# EAGLE design Interface_Board_V1.0 (EAGLE 9.1.1)
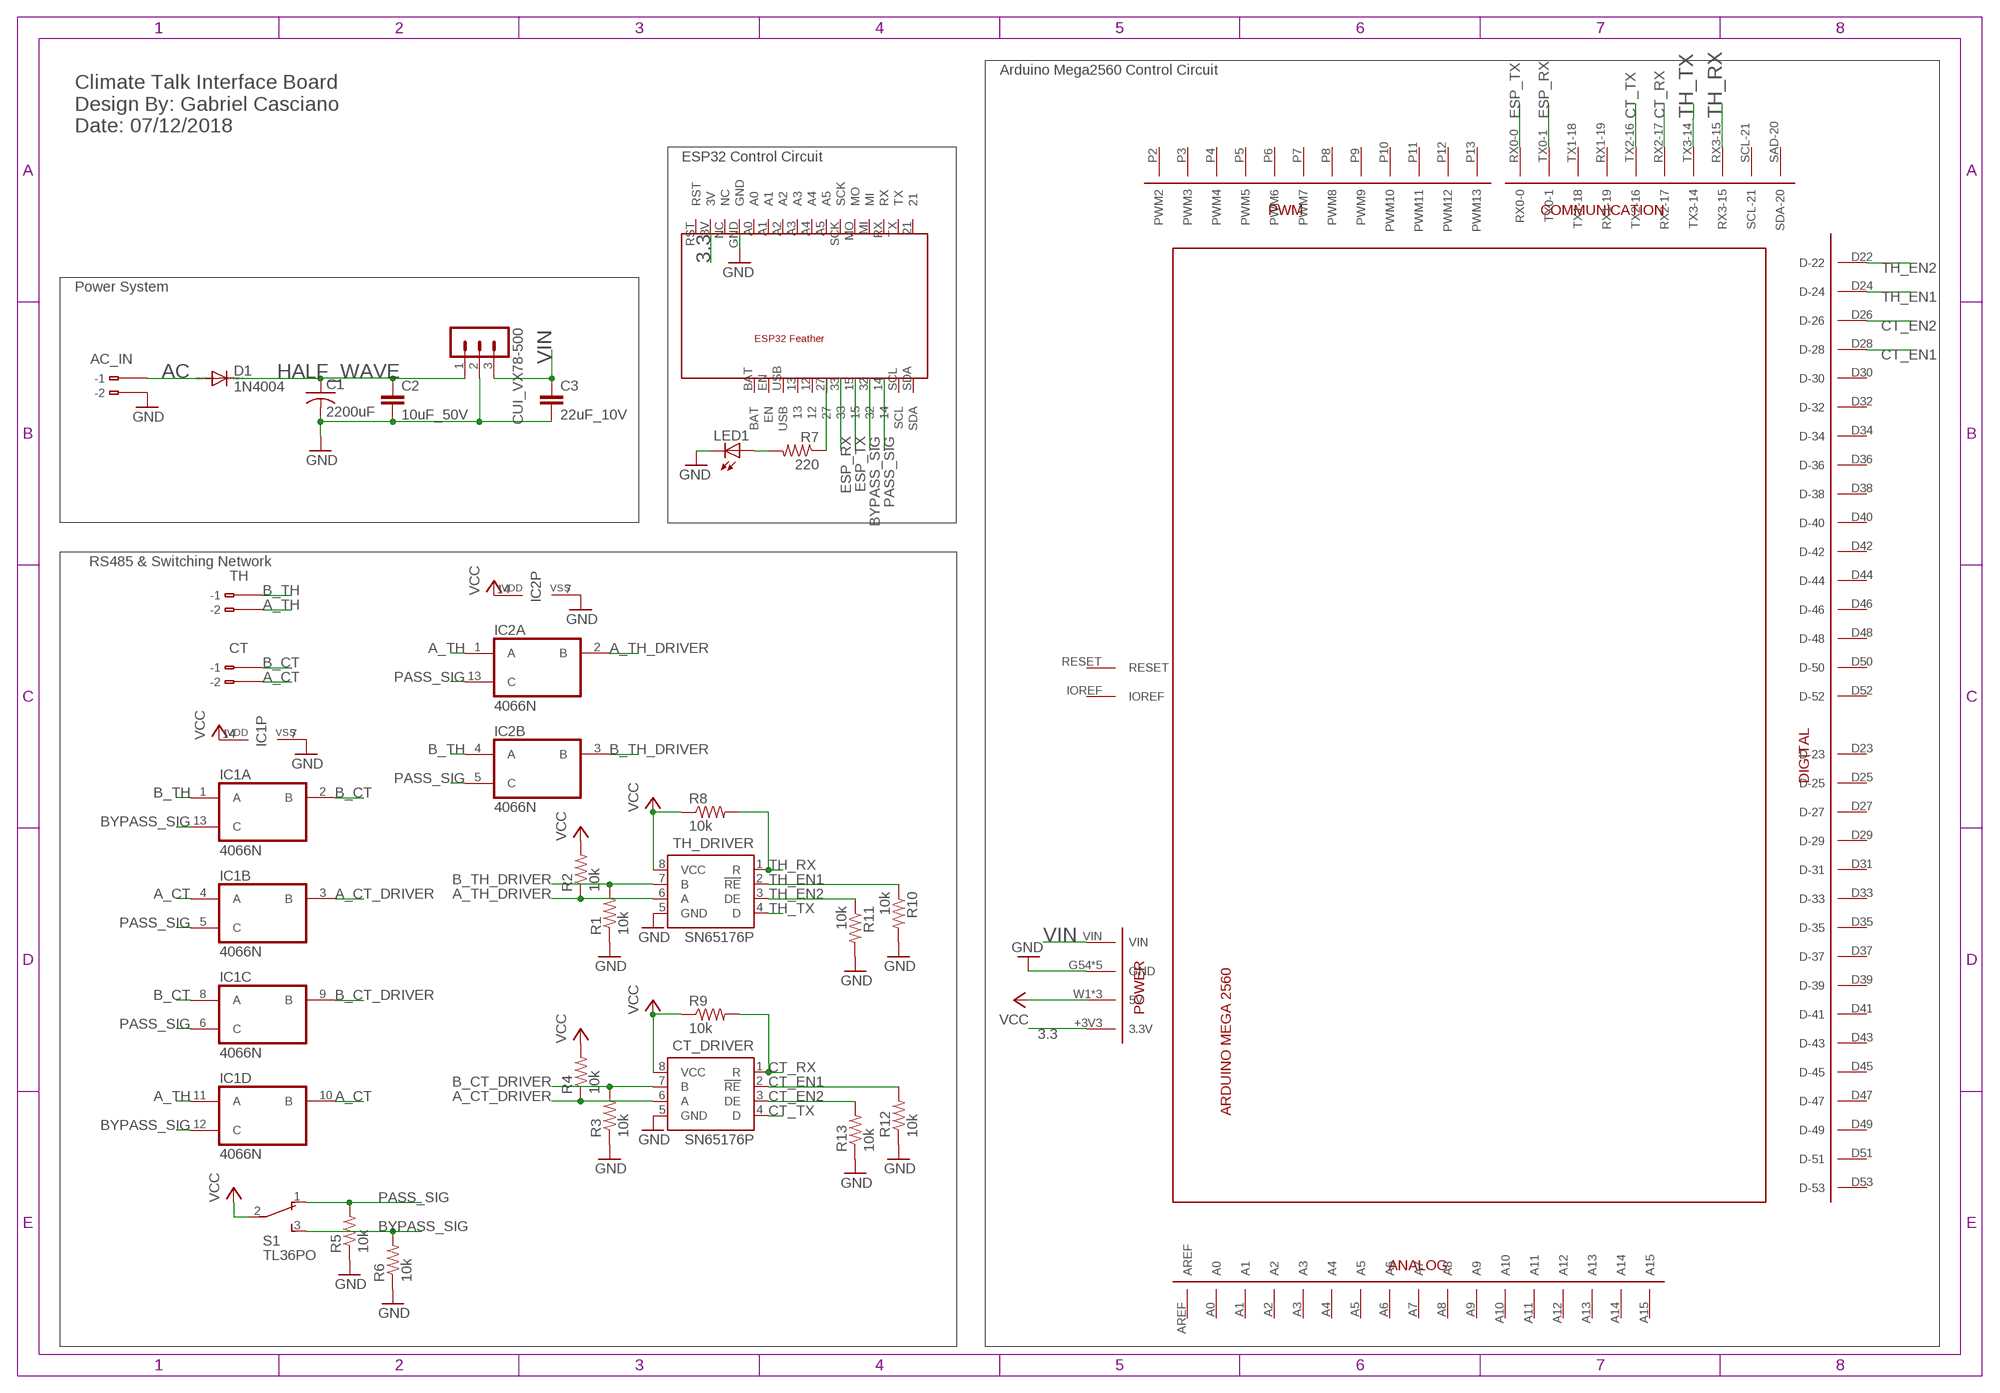
[diagram p0: schematic, sheet 1]

## Parts
AC_IN  233-102  [233-102]
C1  2200uF  C-US102-054X133  [C102-054X133]
C2  10uF_50V  C-EU025-025X050  [C025-025X050]
C3  22uF_10V  C-EU025-025X050  [C025-025X050]
CT  233-102  [233-102]
CT_DRIVER  SN65176P  [DIL08]
CUI_VX78-500  MA03-1  [MA03-1]
D1  1N4004  [DO41-10]
IC1  4066N  [DIL14]
IC2  4066N  [DIL14]
LED1  LED5MM  [LED5MM]
R1  10k  R-US_0204/7  [0204/7]
R2  10k  R-US_0204/7  [0204/7]
R3  10k  R-US_0204/7  [0204/7]
R4  10k  R-US_0204/7  [0204/7]
R5  10k  R-US_0204/7  [0204/7]
R6  10k  R-US_0204/7  [0204/7]
R7  220  R-US_0204/7  [0204/7]
R8  10k  R-US_0204/7  [0204/7]
R9  10k  R-US_0204/7  [0204/7]
R10  10k  R-US_0204/7  [0204/7]
R11  10k  R-US_0204/7  [0204/7]
R12  10k  R-US_0204/7  [0204/7]
R13  10k  R-US_0204/7  [0204/7]
S1  TL36PO  [TL3XPO]
S2  ESP32  [ESP32]
TH  233-102  [233-102]
TH_DRIVER  SN65176P  [DIL08]
U$1  BOARD_ARDUINO-MEGA  [BOARD_ARDUINO_MEGA]

## Nets
3.3: S2.3V U$1.+3V3(3.3V)
A_CT: CT.B2(B-2) IC1.4(B:A) IC1.10(D:B)
A_CT_DRIVER: CT_DRIVER.6(A) IC1.3(B:B) R4.1
A_TH: IC1.11(D:A) IC2.1(A:A) TH.B2(B-2)
A_TH_DRIVER: IC2.2(A:B) R2.1 TH_DRIVER.6(A)
AC: AC_IN.B1(B-1) D1.A
B_CT: CT.B1(B-1) IC1.2(A:B) IC1.8(C:A)
B_CT_DRIVER: CT_DRIVER.7(B) IC1.9(C:B) R3.2
B_TH: IC1.1(A:A) IC2.4(B:A) TH.B1(B-1)
B_TH_DRIVER: IC2.3(B:B) R1.2 TH_DRIVER.7(B)
BYPASS_SIG: IC1.12(D:C) IC1.13(A:C) R6.2 S1.3(S) S2.32
CT_EN1: CT_DRIVER.2(!RE) R12.2 U$1.D28(D-28)
CT_EN2: CT_DRIVER.3(DE) R13.2 U$1.D26(D-26)
CT_RX: CT_DRIVER.1(R) R9.2 U$1.RX2-17
CT_TX: CT_DRIVER.4(D) U$1.TX2-16
ESP_RX: S2.33 U$1.TX0-1
ESP_TX: S2.15 U$1.RX0-0
GND: AC_IN.B2(B-2) C1.2 C2.2 C3.2 CT_DRIVER.5(GND) CUI_VX78-500.2 IC1.7(P:VSS) IC2.7(P:VSS) LED1.K(C) R1.1 R3.1 R5.1 R6.1 R10.2 R11.2 R12.1 R13.1 S2.GND TH_DRIVER.5(GND) U$1.G54(GND) U$1.G55(GND) U$1.G56(GND) U$1.G57(GND) U$1.G58(GND)
HALF_WAVE: C1.1 C2.1 CUI_VX78-500.1 D1.C
N$2: LED1.A R7.2
N$4: R7.1 S2.27
PASS_SIG: IC1.5(B:C) IC1.6(C:C) IC2.5(B:C) IC2.13(A:C) R5.2 S1.1(O) S2.14
TH_EN1: R10.1 TH_DRIVER.2(!RE) U$1.D24(D-24)
TH_EN2: R11.1 TH_DRIVER.3(DE) U$1.D22(D-22)
TH_RX: R8.2 TH_DRIVER.1(R) U$1.RX3-15
TH_TX: TH_DRIVER.4(D) U$1.TX3-14
VCC: CT_DRIVER.8(VCC) IC1.14(P:VDD) IC2.14(P:VDD) R2.2 R4.2 R8.1 R9.1 S1.2(P) TH_DRIVER.8(VCC) U$1.W1(5V) U$1.W2(5V) U$1.W3(5V)
VIN: C3.1 CUI_VX78-500.3 U$1.VIN
Unconnected: AC_IN.A1(-1) AC_IN.A2(-2) CT.A1(-1) CT.A2(-2) IC2.6(C:C) IC2.8(C:A) IC2.9(C:B) IC2.10(D:B) IC2.11(D:A) IC2.12(D:C) S2.12 S2.13 S2.21 S2.A0 S2.A1 S2.A2 S2.A3 S2.A4 S2.A5 S2.BAT S2.EN S2.MI S2.MO S2.NC S2.RST S2.RX S2.SCK S2.SCL S2.SDA S2.TX S2.USB TH.A1(-1) TH.A2(-2) U$1.A0 U$1.A1 U$1.A2 U$1.A3 U$1.A4 U$1.A5 U$1.A6 U$1.A7 U$1.A8 U$1.A9 U$1.A10 U$1.A11 U$1.A12 U$1.A13 U$1.A14 U$1.A15 U$1.AREF U$1.D23(D-23) U$1.D25(D-25) U$1.D27(D-27) U$1.D29(D-29) U$1.D30(D-30) U$1.D31(D-31) U$1.D32(D-32) U$1.D33(D-33) U$1.D34(D-34) U$1.D35(D-35) U$1.D36(D-36) U$1.D37(D-37) U$1.D38(D-38) U$1.D39(D-39) U$1.D40(D-40) U$1.D41(D-41) U$1.D42(D-42) U$1.D43(D-43) U$1.D44(D-44) U$1.D45(D-45) U$1.D46(D-46) U$1.D47(D-47) U$1.D48(D-48) U$1.D49(D-49) U$1.D50(D-50) U$1.D51(D-51) U$1.D52(D-52) U$1.D53(D-53) U$1.IOREF U$1.P2(PWM2) U$1.P3(PWM3) U$1.P4(PWM4) U$1.P5(PWM5) U$1.P6(PWM6) U$1.P7(PWM7) U$1.P8(PWM8) U$1.P9(PWM9) U$1.P10(PWM10) U$1.P11(PWM11) U$1.P12(PWM12) U$1.P13(PWM13) U$1.RESET U$1.RX1-19 U$1.SAD-20(SDA-20) U$1.SCL-21 U$1.TX1-18

## Notes on the sheet
- Arduino Mega2560 Control Circuit
- Climate Talk Interface Board
  Design By: Gabriel Casciano
  Date: 07/12/2018
- ESP32 Control Circuit
- Power System
- RS485 & Switching Network

## Library data of the parts
AC_IN CT TH = con-wago:233-102: WAGO Cage Clamp; MPN: 233-102; OC_FARNELL: unknown; OC_NEWARK: 28K9044
C1 = resistor:C-US: CAPACITOR, American symbol
C2 C3 = resistor:C-EU: CAPACITOR, European symbol
CT_DRIVER TH_DRIVER = texas:SN65176: DIFFERENTIAL BUS TRANSCEIVER Source: http://focus.ti.com .. sn65176b.pdf; MF: TEXAS INSTRUMENTS; MPN: SN65176BP; OC_FARNELL: 1755024; OC_NEWARK: 60K6785
CUI_VX78-500 = con-lstb:MA03-1: PIN HEADER; OC_FARNELL: unknown; OC_NEWARK: unknown
D1 = diode:1N4004: DIODE general purpose rectifier, 1 A
IC1 IC2 = 40xx:4066: Quad bilateral ANALOG SWITCH
LED1 = led:LED: LED OSRAM: - CHIPLED LG R971, LG N971, LY N971, LG Q971, LY Q971, LO R971, LY R971 LH N974, LH R974 LS Q976, LO Q976, LY Q976 LO Q996 - Hyper CHIPLED LW Q18S LB Q993, LB Q99A, LB R99A - SideLED LS A670, LO A670, LY A670, LG A670, LP A670 LB A673, LV A673, LT A673, LW A673 LH A674 LY A675 LS A676, LA A676, LO A676, LY A676, LW A676 LS A679, LY A679, LG A679 - Hyper Micro SIDELED® LS Y876, LA Y876, LO Y876, LY Y876 LT Y87S - SmartLED LW L88C, LW L88S LB L89C, LB L89S, LG L890 LS L89K, LO L89K, LY L89K LS L896, LA L896, LO L896, LY L896 - TOPLED LS T670, LO T670, LY T670, LG T670, LP T670 LSG T670, LSP T670, LSY T670, LOP T670, LYG T670 LG T671, LOG T671, LSG T671 LB T673, LV T673, LT T673, LW T673 LH T674 LS T676, LA T676, LO T676, LY T676, LB T676, LH T676, LSB T676, LW T676 LB T67C, LV T67C, LT T67C, LS T67K, LO T67K, LY T67K, LW E67C LS E67B, LA E67B, LO E67B, LY E67B, LB E67C, LV E67C, LT E67C LW T67C LS T679, LY T679, LG T679 LS T770, LO T770, LY T770, LG T770, LP T770 LB T773, LV T773, LT T773, LW T773 LH T774 LS E675, LA E675, LY E675, LS T675 LS T776, LA T776, LO T776, LY T776, LB T776 LHGB T686 LT T68C, LB T68C - Hyper Mini TOPLED® LB M676 - Mini TOPLED Santana® LG M470 LS M47K, LO M47K, LY M47K Source: http://www.osram.convergy.de LUXEON: - LUMILED® LXK2-PW12-R00, LXK2-PW12-S00, LXK2-PW14-U00, LXK2-PW14-V00 LXK2-PM12-R00, LXK2-PM12-S00, LXK2-PM14-U00 LXK2-PE12-Q00, LXK2-PE12-R00, LXK2-PE12-S00, LXK2-PE14-T00, LXK2-PE14-U00 LXK2-PB12-K00, LXK2-PB12-L00, LXK2-PB12-M00, LXK2-PB14-N00, LXK2-PB14-P00, LXK2-PB14-Q00 LXK2-PR12-L00, LXK2-PR12-M00, LXK2-PR14-Q00, LXK2-PR14-R00 LXK2-PD12-Q00, LXK2-PD12-R00, LXK2-PD12-S00 LXK2-PH12-R00, LXK2-PH12-S00 LXK2-PL12-P00, LXK2-PL12-Q00, LXK2-PL12-R00 Source: www.luxeon.com KINGBRIGHT: KA-3528ASYC Source: www.kingbright.com
R1-R13 = resistor:R-US_: RESISTOR, American symbol
S1 = switch:TL36PO: TINY SWITCH ON - ON Source: http://www2.produktinfo.conrad.com/datenblaetter/700000-724999/705152-da-01-de-Subminiaturschalter_TL_36YO.pdf
S2 = ESP32:ESP32
U$1 = Clean-Kong:BOARD_ARDUINO-MEGA

## Board
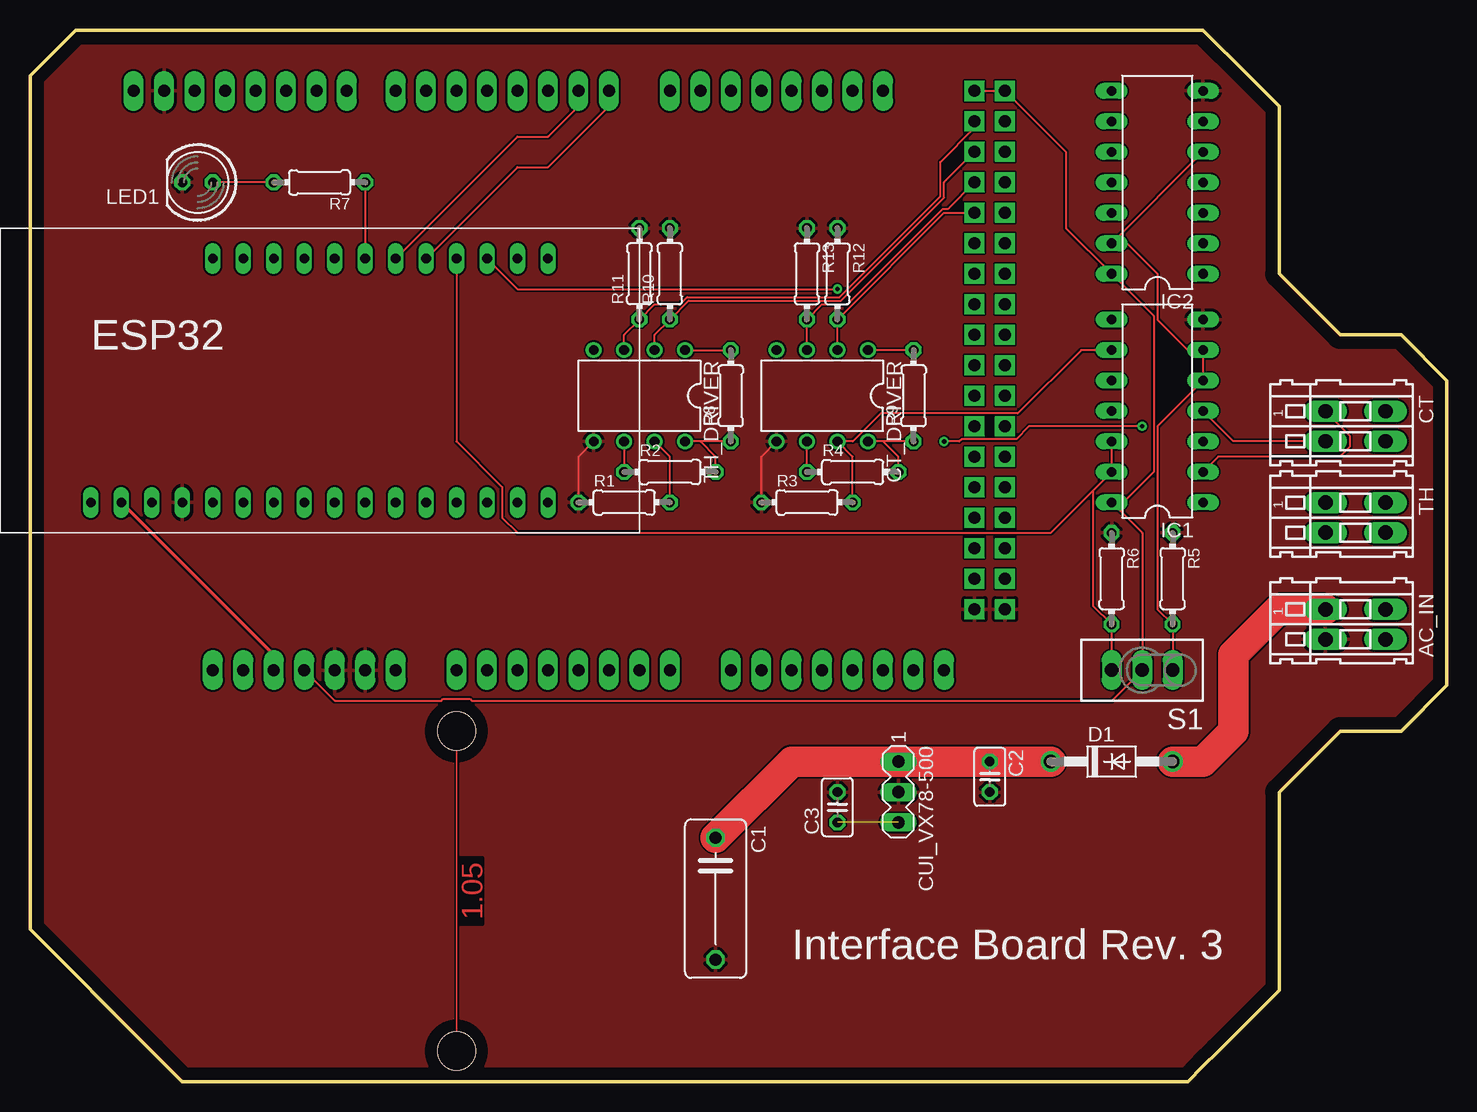
[diagram p1: board, top side]
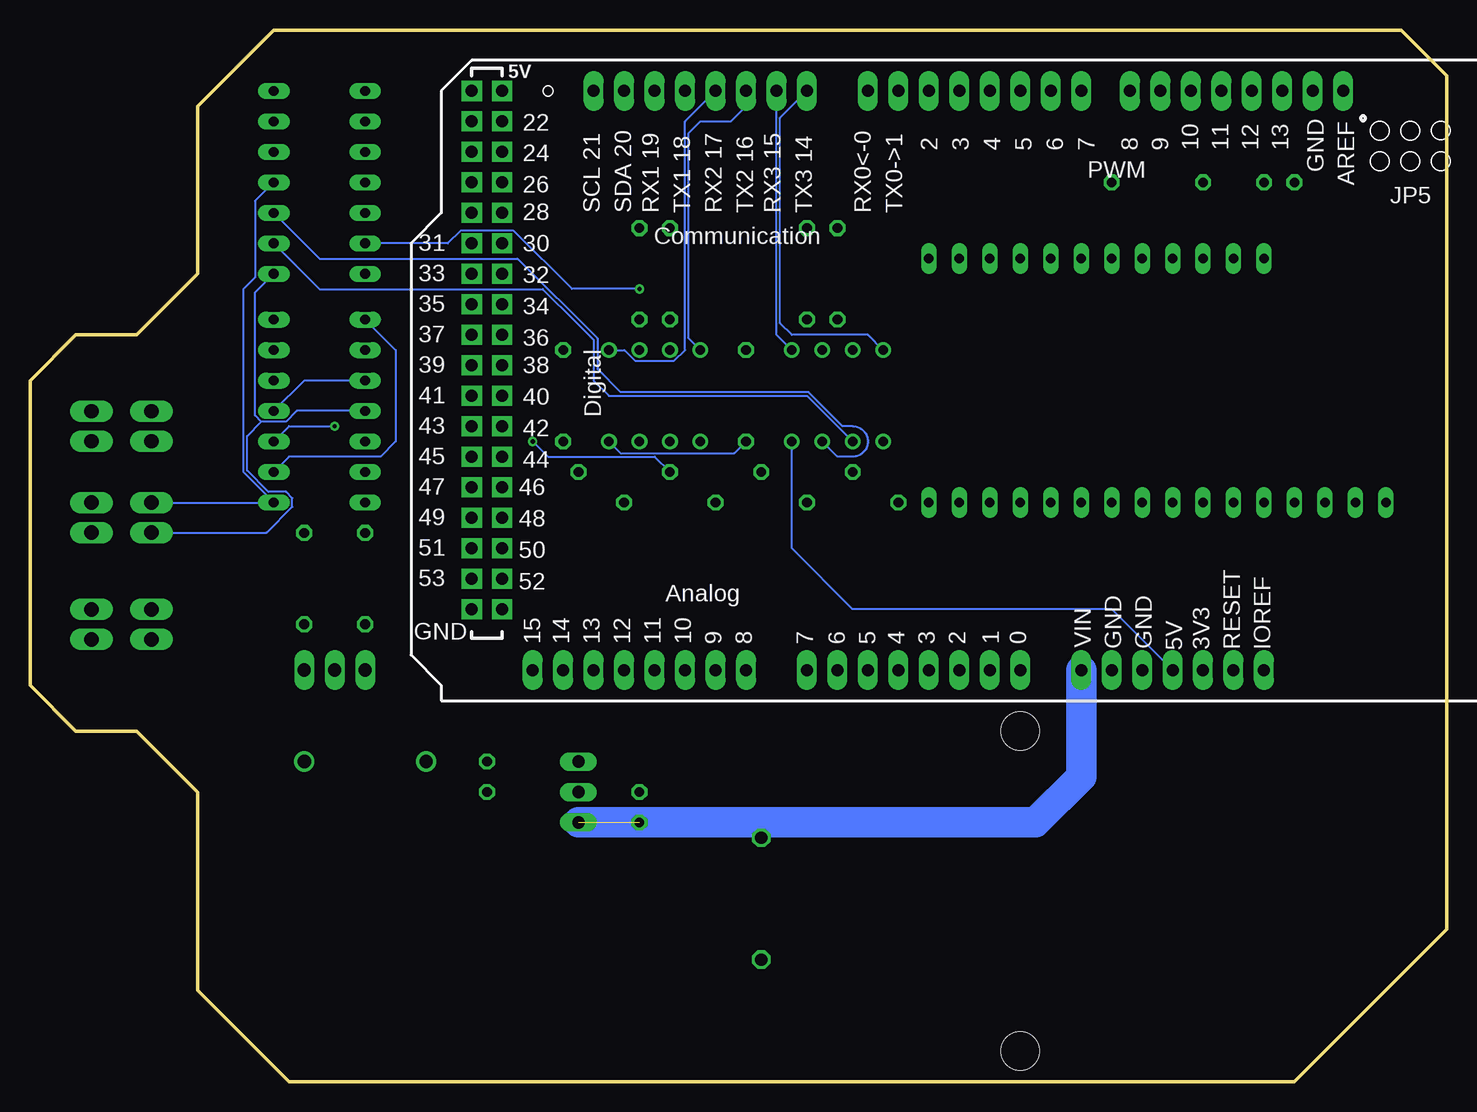
[diagram p2: board, bottom side, seen from below]

Size 118.11 x 87.63 mm. Coordinates in mm from the lower left corner, seen from the top.
Outline: 0,48.26 0,83.82 3.81,87.63 97.79,87.63 101.6,83.82 104.14,81.28 104.14,67.31 109.22,62.23 113.03,62.23 114.3,62.23 118.11,58.42 118.11,33.02 114.3,29.21 109.22,29.21 104.14,24.13 104.14,7.62 99.06,2.54 97.79,1.27 96.52,0 12.7,0 10.16,2.54 0,12.7 0,48.26
Copper layers (1*16): Top 0.035mm / dielectric 1.5mm / Bottom 0.035mm
Design rules "default": minimum track width 6mil, minimum drill 0.35mm, track to track 6mil, track to pad 6mil, pad to pad 6mil, via to via 6mil, smd to smd 6mil, copper to edge 40mil, drill to drill 6mil, minimum pad ring 10mil, minimum via ring 8mil, stop-mask expansion 4mil, vias tented up to drill 0mil, thermal gap 10mil
Holes 3.17 mm at 35.56,29.21 35.56,2.54

### Footprints (pad centres in the part's own frame; a part is rotated, then mirrored left to right if it is on the bottom)
233-102 = drill 1.2 long: A1 -1.25,2.5; A2 1.25,2.5; B1 -1.25,-2.5; B2 1.25,-2.5
C102-054X133 = drill 1.016 octagon: 1 -5.08,0; 2 5.08,0
C025-025X050 = drill 0.813 octagon: 1 -1.27,0; 2 1.27,0
DIL08 = drill 0.813 pad 1.27: 1 -3.81,-3.81; 2 -1.27,-3.81; 3 1.27,-3.81; 4 3.81,-3.81; 5 3.81,3.81; 6 1.27,3.81; 7 -1.27,3.81; 8 -3.81,3.81
MA03-1 = drill 1.016 long: 1 -2.54,0; 2 0,0; 3 2.54,0
DO41-10 = drill 1.118: A 5.08,0; C -5.08,0
DIL14 = drill 0.813 long: 1 -7.62,-3.81; 2 -5.08,-3.81; 3 -2.54,-3.81; 4 0,-3.81; 5 2.54,-3.81; 6 5.08,-3.81; 7 7.62,-3.81; 8 7.62,3.81; 9 5.08,3.81; 10 2.54,3.81; 11 0,3.81; 12 -2.54,3.81; 13 -5.08,3.81; 14 -7.62,3.81
LED5MM = drill 0.813 octagon: A -1.27,0; K 1.27,0
0204/7 = drill 0.813 octagon: 1 -3.81,0; 2 3.81,0
TL3XPO = drill 1.1 pad 1.422 long: 1 -2.54,0; 2 0,0; 3 2.54,0
ESP32 = drill 0.8 long: 3V 0,-25.4; 12 -20.32,-7.62; 13 -20.32,-10.16; 14 -20.32,5.08; 15 -20.32,0; 21 0,10.16; 27 -20.32,-5.08; 32 -20.32,2.54; 33 -20.32,-2.54; A0 0,-17.78; A1 0,-15.24; A2 0,-12.7; A3 0,-10.16; A4 0,-7.62; A5 0,-5.08; BAT -20.32,-17.78; EN -20.32,-15.24; GND 0,-20.32; MI 0,2.54; MO 0,0; NC 0,-22.86; RST 0,-27.94; RX 0,5.08; SCK 0,-2.54; SCL -20.32,7.62; SDA -20.32,10.16; TX 0,7.62; USB -20.32,-12.7
BOARD_ARDUINO_MEGA = drill 1 pad 1.676 long: +3V3 35.56,50.8; A0 50.8,50.8; A1 53.34,50.8; A2 55.88,50.8; A3 58.42,50.8; A4 60.96,50.8; A5 63.5,50.8; A6 66.04,50.8; A7 68.58,50.8; A8 73.66,50.8; A9 76.2,50.8; A10 78.74,50.8; A11 81.28,50.8; A12 83.82,50.8; A13 86.36,50.8; A14 88.9,50.8; A15 91.44,50.8; AREF 23.876,2.54; G56 43.18,50.8; G57 40.64,50.8; G58 26.416,2.54; IOREF 30.48,50.8; P2 58.42,2.54; P3 55.88,2.54; P4 53.34,2.54; P5 50.8,2.54; P6 48.26,2.54; P7 45.72,2.54; P8 41.656,2.54; P9 39.116,2.54; P10 36.576,2.54; P11 34.036,2.54; P12 31.496,2.54; P13 28.956,2.54; RESET 33.02,50.8; RX0-0 63.5,2.54; RX1-19 81.28,2.54; RX2-17 76.2,2.54; RX3-15 71.12,2.54; SAD-20 83.82,2.54; SCL-21 86.36,2.54; TX0-1 60.96,2.54; TX1-18 78.74,2.54; TX2-16 73.66,2.54; TX3-14 68.58,2.54; VIN 45.72,50.8; W1 38.1,50.8 | drill 1 pad 1.676 square: D22 93.98,5.08; D23 96.52,5.08; D24 93.98,7.62; D25 96.52,7.62; D26 93.98,10.16; D27 96.52,10.16; D28 93.98,12.7; D29 96.52,12.7; D30 93.98,15.24; D31 96.52,15.24; D32 93.98,17.78; D33 96.52,17.78; D34 93.98,20.32; D35 96.52,20.32; D36 93.98,22.86; D37 96.52,22.86; D38 93.98,25.4; D39 96.52,25.4; D40 93.98,27.94; D41 96.52,27.94; D42 93.98,30.48; D43 96.52,30.48; D44 93.98,33.02; D45 96.52,33.02; D46 93.98,35.56; D47 96.52,35.56; D48 93.98,38.1; D49 96.52,38.1; D50 93.98,40.64; D51 96.52,40.64; D52 93.98,43.18; D53 96.52,43.18; G54 93.98,45.72; G55 96.52,45.72; W2 93.98,2.54; W3 96.52,2.54

### Placement (x,y rotation side)
AC_IN  110.49,38.1 270 top
C1  57.15,15.24 270 top
C2  80.01,25.4 270 top
C3  67.31,22.86 90 top
CT  110.49,54.61 270 top
CT_DRIVER  66.04,57.15 180 top
CUI_VX78-500  72.39,24.13 270 top
D1  90.17,26.67 0 top
IC1  93.98,55.88 90 top
IC2  93.98,74.93 90 top
LED1  13.97,74.93 180 top
R1  49.53,48.26 0 top
R2  53.34,50.8 0 top
R3  64.77,48.26 0 top
R4  68.58,50.8 0 top
R5  95.25,41.91 270 top
R6  90.17,41.91 270 top
R7  24.13,74.93 180 top
R8  58.42,57.15 90 top
R9  73.66,57.15 90 top
R10  53.34,67.31 90 top
R11  50.8,67.31 90 top
R12  67.31,67.31 270 top
R13  64.77,67.31 270 top
S1  92.71,34.29 180 top
S2  33.02,48.26 270 top
TH  110.49,46.99 270 top
TH_DRIVER  50.8,57.15 180 top
U$1  -15.24,85.09 180 bottom

### Tracks (layer width: path | path; a pad name or v marks a point on that pad's centre or on a via)
3.3
  Top 0.305: S2.3V 20.32,35.56 U$1.+3V3
A_CT
  Top 0.152: CT.B2 100.31,53.36 IC1.4
  Bottom 0.152: IC1.4 95.25,58.42 IC1.10
A_CT_DRIVER  (via drill 0.35)
  Top 0.152: R4.1 CT_DRIVER.6 | v92.71,54.61 83.28,54.61 82.21,53.54 77.67,53.54 77.47,53.34 v76.2,53.34
  Bottom 0.152: IC1.3 96.52,54.61 v92.71,54.61 | v76.2,53.34 74.93,52.07 66.04,52.07 R4.1
A_TH
  Bottom 0.152: 107.97,45.72 TH.B2 98.39,45.74 96.24,47.89 96.24,48.63 96.76,49.15 98.25,49.15 100.02,50.93 100.02,53.78 98.82,54.99 | 98.82,54.99 96.76,54.99 95.87,55.88 IC1.11 | 98.82,54.99 99.34,55.51 99.34,65.76 IC2.1
A_TH_DRIVER
  Top 0.152: TH_DRIVER.6 R2.1
  Bottom 0.152: IC2.2 93.98,66.04 75.36,66.04 72.61,63.28 | 72.61,63.28 72.52,63.2 | 72.61,63.28 71.12,61.8 71.12,58.42 69.85,57.15 53.34,57.15 TH_DRIVER.6
AC
  Top 2.54: AC_IN.B1 104.12,39.35 100.33,35.56 100.33,29.21 97.79,26.67 D1.A
B_CT
  Top 0.152: 107.97,55.88 CT.B1 110.02,53.83 110.02,52.89 109.22,52.09 109.22,52.07 99.06,52.07 IC1.2
  Bottom 0.152: 88.9,63.5 IC1.8 87.63,60.96 87.63,53.34 88.9,52.07 96.52,52.07 IC1.2
B_CT_DRIVER
  Top 0.152: R3.2 68.58,52.07 CT_DRIVER.7 68.59,53.34 70.93,55.68 82.35,55.68 87.63,60.96 IC1.9
B_TH
  Top 0.152: TH.B1 107.97,48.26
  Bottom 0.152: IC2.4 99.34,73.38 99.34,67.03 100.33,66.04 100.33,50.8 97.81,48.28 97.81,48.24 | TH.B1 97.81,48.24 | 97.81,48.24 IC1.1
B_TH_DRIVER
  Top 0.152: R1.2 53.34,52.07 TH_DRIVER.7
  Bottom 0.152: IC2.3 93.98,68.58 77.47,68.58 70.81,61.93 70.81,59.39 68.88,57.46 53.21,57.46 50.37,54.61 49.53,54.61 arc90 48.26,53.34 arc90 49.53,52.07 50.8,52.07 TH_DRIVER.7
BYPASS_SIG
  Top 0.152: IC1.12 IC1.13 88.9,49.53 88.62,49.25 | S1.3 R6.2 88.62,39.65 88.62,49.25 | S2.32 35.56,53.34 39.37,49.53 39.37,46.99 40.64,45.72 85.09,45.72 88.62,49.25
CT_EN1
  Top 0.152: CT_DRIVER.2 R12.2 76.2,72.39 U$1.D28
CT_EN2
  Top 0.152: CT_DRIVER.3 R13.2 66.04,64.77 68.15,64.77 76.07,72.7 76.5,72.7 U$1.D26
CT_RX
  Top 0.152: R9.2 CT_DRIVER.1
  Bottom 0.152: CT_DRIVER.1 68.57,60.96 67.68,60.07 64.4,60.07 63.51,60.96 63.5,60.96 63.5,80.01 U$1.RX2-17
CT_TX
  Bottom 0.152: CT_DRIVER.4 63.2,61.93 63.2,79.05 62.23,80.01 59.69,80.01 58.42,81.28 U$1.TX2-16
ESP_RX
  Top 0.152: S2.33 40.64,78.74 43.18,78.74 45.72,81.28 U$1.TX0-1
ESP_TX
  Top 0.152: S2.15 40.64,76.2 43.18,76.2 48.26,81.28 U$1.RX0-0
GND
  Top 0.152: R3.1 60.96,52.07 CT_DRIVER.5 | R1.1 45.72,52.07 TH_DRIVER.5
  pour Top: -3.81,91.44 100.33,91.44 124.46,67.31 124.46,-1.27 120.65,-5.08 -1.27,-5.08 -3.81,-2.54
HALF_WAVE
  Top 2.54: D1.C C2.1 CUI_VX78-500.1 63.5,26.67 C1.1
N$2
  Top 0.152: R7.2 LED1.A
N$4
  Top 0.152: R7.1 S2.27
PASS_SIG  (via drill 0.35)
  Top 0.152: IC2.5 IC2.13 91.44,69.85 93.98,67.31 93.98,63.5 96.52,60.96 IC1.6 IC1.5 93.98,54.61 93.98,39.37 R5.2 S1.1 | S2.14 40.64,66.04 v67.29,66.04 v67.3,66.05
  Bottom 0.152: v67.3,66.05 72.94,66.05 77.81,70.92 82.21,70.92 83.28,69.85 IC2.13
TH_EN1
  Top 0.152: TH_DRIVER.2 52.07,62.23 R10.1 54.92,65.08 67.61,65.08 76.2,73.66 76.2,74.93 U$1.D24
TH_EN2
  Top 0.152: TH_DRIVER.3 49.53,62.23 R11.1 52.07,64.77 54.18,64.77 54.79,65.38 67.49,65.38 75.89,73.79 75.89,76.62 78.74,79.47 U$1.D22
TH_RX
  Top 0.152: TH_DRIVER.1 R8.2
  Bottom 0.152: TH_DRIVER.1 55.88,62.23 U$1.RX3-15
TH_TX
  Bottom 0.152: TH_DRIVER.4 48.26,62.23 54.61,62.23 55.58,63.2 55.58,80.31 U$1.TX3-14
VCC
  Top 0.152: R8.1 55.88,53.34 | 55.88,53.34 TH_DRIVER.8 | R9.1 71.12,53.34 | 71.12,53.34 CT_DRIVER.8 | R4.2 72.39,52.07 71.12,53.34 | R2.2 57.15,52.07 55.88,53.34 | U$1.W2 U$1.W3 86.36,77.47 86.36,71.12 IC2.14 93.67,63.8 93.67,50.8 91.13,48.26 IC1.14 92.71,45.72 S1.2 90.17,31.75 36.81,31.75 36.67,31.89 34.45,31.89 34.31,31.75 25.4,31.75 U$1.W1
  Bottom 0.152: U$1.W1 27.94,39.37 49.53,39.37 54.61,44.45 TH_DRIVER.8 | CT_DRIVER.8 68.88,52.38 59.39,52.38 R8.1
VIN  (1 unrouted)
  Bottom 2.54: U$1.VIN 30.48,25.4 34.29,21.59 CUI_VX78-500.3
(copper drawn outside any net)
  shapes: Top area x1

### Text on the board
tPlace: Interface Board Rev. 3